# EAGLE design amiga-pcb-led (EAGLE 7.7.0)
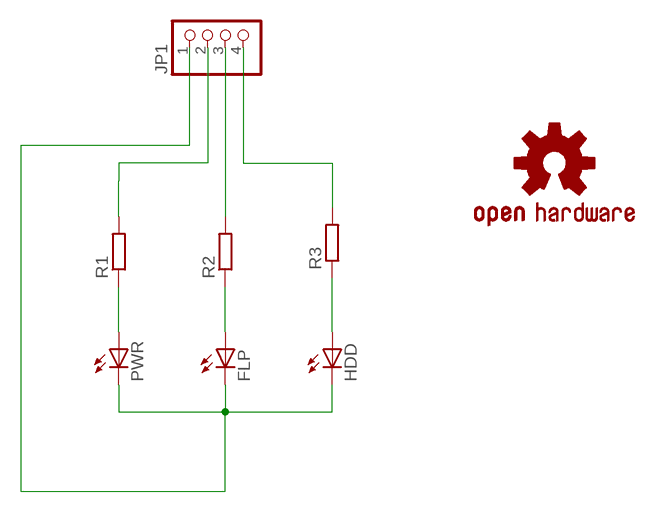
[diagram p0: schematic, sheet 1]

## Parts
FLP  LEDSQR2X5  [LED2X5]
HDD  LEDSQR2X5  [LED2X5]
JP1  PINHD-1X4  [1X04]
LOGO2  OSHW-LOGOS-COPPER  [OSHW-LOGO-S_COPPER]
PWR  LEDSQR2X5  [LED2X5]
R1  R-EU_R0603  [R0603]
R2  R-EU_R0603  [R0603]
R3  R-EU_R0603  [R0603]

## Nets
GND: FLP.K(C) HDD.K(C) JP1.1 PWR.K(C)
N$1: PWR.A R1.1
N$2: FLP.A R2.1
N$3: HDD.A R3.1
N$4: JP1.2 R1.2
N$5: JP1.3 R2.2
N$6: JP1.4 R3.2

## Library data of the parts
FLP HDD PWR = led:LED: LED OSRAM: - CHIPLED LG R971, LG N971, LY N971, LG Q971, LY Q971, LO R971, LY R971 LH N974, LH R974 LS Q976, LO Q976, LY Q976 LO Q996 - Hyper CHIPLED LW Q18S LB Q993, LB Q99A, LB R99A - SideLED LS A670, LO A670, LY A670, LG A670, LP A670 LB A673, LV A673, LT A673, LW A673 LH A674 LY A675 LS A676, LA A676, LO A676, LY A676, LW A676 LS A679, LY A679, LG A679 - Hyper Micro SIDELED® LS Y876, LA Y876, LO Y876, LY Y876 LT Y87S - SmartLED LW L88C, LW L88S LB L89C, LB L89S, LG L890 LS L89K, LO L89K, LY L89K LS L896, LA L896, LO L896, LY L896 - TOPLED LS T670, LO T670, LY T670, LG T670, LP T670 LSG T670, LSP T670, LSY T670, LOP T670, LYG T670 LG T671, LOG T671, LSG T671 LB T673, LV T673, LT T673, LW T673 LH T674 LS T676, LA T676, LO T676, LY T676, LB T676, LH T676, LSB T676, LW T676 LB T67C, LV T67C, LT T67C, LS T67K, LO T67K, LY T67K, LW E67C LS E67B, LA E67B, LO E67B, LY E67B, LB E67C, LV E67C, LT E67C LW T67C LS T679, LY T679, LG T679 LS T770, LO T770, LY T770, LG T770, LP T770 LB T773, LV T773, LT T773, LW T773 LH T774 LS E675, LA E675, LY E675, LS T675 LS T776, LA T776, LO T776, LY T776, LB T776 LHGB T686 LT T68C, LB T68C - Hyper Mini TOPLED® LB M676 - Mini TOPLED Santana® LG M470 LS M47K, LO M47K, LY M47K Source: http://www.osram.convergy.de LUXEON: - LUMILED® LXK2-PW12-R00, LXK2-PW12-S00, LXK2-PW14-U00, LXK2-PW14-V00 LXK2-PM12-R00, LXK2-PM12-S00, LXK2-PM14-U00 LXK2-PE12-Q00, LXK2-PE12-R00, LXK2-PE12-S00, LXK2-PE14-T00, LXK2-PE14-U00 LXK2-PB12-K00, LXK2-PB12-L00, LXK2-PB12-M00, LXK2-PB14-N00, LXK2-PB14-P00, LXK2-PB14-Q00 LXK2-PR12-L00, LXK2-PR12-M00, LXK2-PR14-Q00, LXK2-PR14-R00 LXK2-PD12-Q00, LXK2-PD12-R00, LXK2-PD12-S00 LXK2-PH12-R00, LXK2-PH12-S00 LXK2-PL12-P00, LXK2-PL12-Q00, LXK2-PL12-R00 Source: www.luxeon.com KINGBRIGHT: KA-3528ASYC Source: www.kingbright.com
JP1 = pinhead:PINHD-1X4: PIN HEADER
LOGO2 = SparkFun-Aesthetics:OSHW-LOGO: Open-Source Hardware (OSHW) Logo This logo indicates the piece of hardware it is found on incorporates a OSHW license and/or adheres to the definition of open source hardware found here: http://freedomdefined.org/OSHW
R1-R3 = rcl:R-EU_: RESISTOR, European symbol

## Board
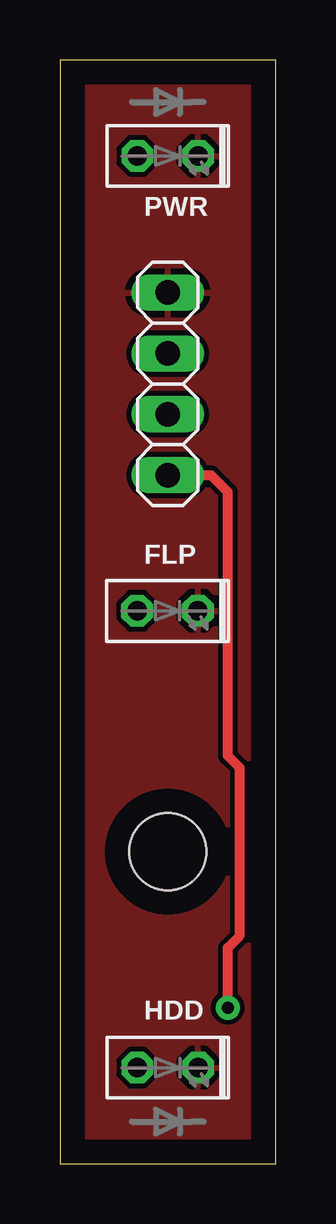
[diagram p1: board, top side]
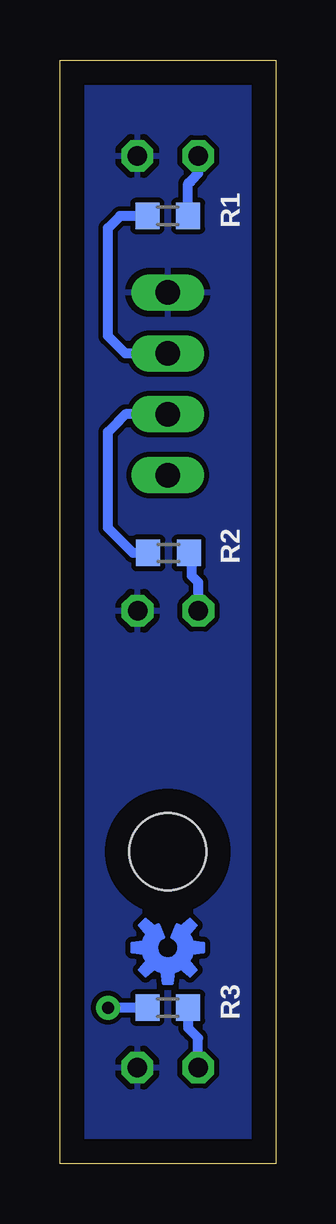
[diagram p2: board, bottom side, seen from below]

Size 9 x 46 mm. Coordinates in mm from the lower left corner, seen from the top.
Outline: 0,0 9,0 9,46 0,46 0,0
Copper layers (1*16): Top 0.035mm / dielectric 1.5mm / Bottom 0.035mm
Design rules "default": minimum track width 10mil, minimum drill 24mil, track to track 8mil, track to pad 8mil, pad to pad 8mil, via to via 8mil, smd to smd 8mil, copper to edge 40mil, drill to drill 8mil, minimum pad ring 10mil, minimum via ring 8mil, stop-mask expansion 4mil, vias tented up to drill 0mil, thermal gap 10mil
Holes 3.2 mm at 4.5,13

### Footprints (pad centres in the part's own frame; a part is rotated, then mirrored left to right if it is on the bottom)
LED2X5 = drill 0.813 octagon: A -1.27,0; K 1.27,0
1X04 = drill 1.016 long: 1 -3.81,0; 2 -1.27,0; 3 1.27,0; 4 3.81,0
R0603 = smd 1 x 1.1: 1 -0.85,0; 2 0.85,0

### Placement (x,y rotation side)
FLP  4.49,23.04 0 top
HDD  4.5,4 0 top
JP1  4.5,32.5 270 top
LOGO2  4.5,9 180 bottom
PWR  4.5,42 0 top
R1  4.5,39.5 180 bottom
R2  4.46,25.45 180 bottom
R3  4.5,6.5 180 bottom

### Tracks (layer width: path | path; a pad name or v marks a point on that pad's centre or on a via)
GND
  pour Bottom: -0.5,47 -0.5,-1 9.5,-1 9.5,47
  pour Top: -0.5,47 -0.5,-1 9.5,-1 9.5,47
N$1
  Bottom 0.406: PWR.A 3.23,41.27 3.5,41 3.65,40.85 R1.1
N$2
  Bottom 0.406: FLP.A 3.22,24.22 3.5,24.5 3.5,25.34 R2.1
N$3
  Bottom 0.406: R3.1 3.65,5.65 3.5,5.5 3.23,5.23 HDD.A
N$4
  Bottom 0.406: R1.2 6.5,39.5 7,39 7,34.5 6.27,33.77 JP1.2
N$5
  Bottom 0.406: R2.2 5.96,25.45 7,26.5 7,30.5 | 7,30.5 6.5,31 | JP1.3 6.27,31.23 7,30.5
N$6  (via drill 0.5 pad 1)
  Top 0.406: v7,6.5 7,8.5 7,9 7.5,9.5 7.5,16.5 7,17 7,28 6.75,28.25 6.31,28.69 JP1.4
  Bottom 0.406: R3.2 v7,6.5

### Text on the board
tDocu: GND | PW | FD | HD | Amiga / LED / Breakout
bDocu: GND | PW | FD | HD